# Altium project Volta_P0_Single_Port.PrjPcb (part 1 of 3)
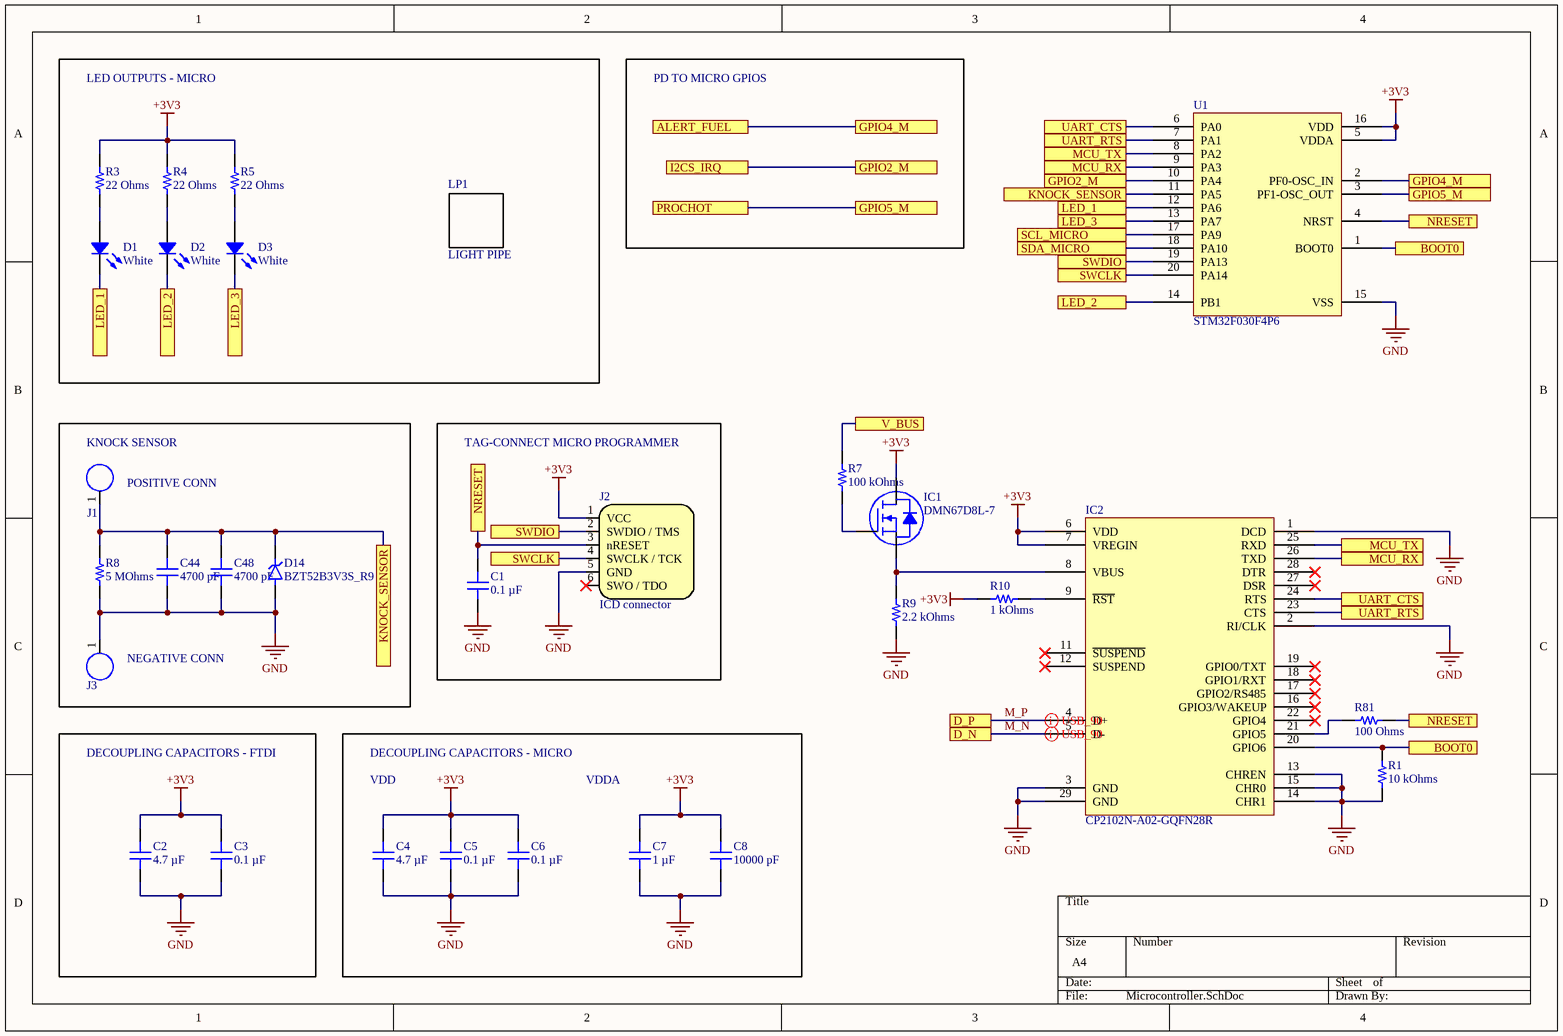
[diagram p0: Microcontroller.SchDoc]
7 sheets, 209 parts. Net scope: flat (ports and power ports of the same name join across sheets).
Board files: PCB.PcbDoc, Panel-Single.PcbDoc, Panel.PcbDoc
Sheets:
  Microcontroller.SchDoc
  PD_Controller_TI.SchDoc
  Charging_TI.SchDoc
  Charging_TI_2.SchDoc
  Fuel_Gauge.SchDoc
  Voltage_Regulation_TI.SchDoc
  I2C.SchDoc

## Sheet Microcontroller.SchDoc
size A4

### Parts
C1  0.1 µF  [CAP 0402_1005]
C2  4.7 µF  [CAP 0402_1005]
C3  0.1 µF  [CAP 0402_1005]
C4  4.7 µF  [CAP 0402_1005]
C5  0.1 µF  [CAP 0402_1005]
C6  0.1 µF  [CAP 0402_1005]
C7  1 µF  [CAP 0402_1005]
C8  10000 pF  [CAP 0402_1005]
C44  4700 pF  [CAP 0402_1005]
C48  4700 pF  [CAP 0402_1005]
D1  White  [LED 0805_2012]
D2  White  [LED 0805_2012]
D3  White  [LED 0805_2012]
D14  BZT52B3V3S_R9  [DIO_BZT52B3V3S_R9]
IC1  DMN67D8L-7  [DIODES SOT-23-3]
IC2  CP2102N-A02-GQFN28R  [SILICON LABS QFN-28 5x5MM]
J1  Large Board Solder Point  [Large Solder Point]  (value not drawn)  (no BOM)
J2  ICD connector  [TC2030-MCP]  (no BOM)
J3  Large Board Solder Point  [Large Solder Point]  (value not drawn)  (no BOM)
LP1  LIGHT PIPE  [Dialight 515-1069F]
R1  10 kOhms  [RES 0402_1005]
R3  22 Ohms  [RES 1206_3216]
R4  22 Ohms  [RES 1206_3216]
R5  22 Ohms  [RES 1206_3216]
R7  100 kOhms  [RES 0603_1608]
R8  5 MOhms  [RES 0603_1608]
R9  2.2 kOhms  [RES 0402_1005]
R10  1 kOhms  [RES 0402_1005]
R81  100 Ohms  [RES 0402_1005]
U1  STM32F030F4P6  [TSOP65P640X120-20N]

### Blocks framed on the sheet
LED OUTPUTS - MICRO: D1-D3 LP1 R3-R5
TAG-CONNECT MICRO PROGRAMMER: C1 J2
DECOUPLING CAPACITORS - FTDI: C2 C3

### Ports
ALERT_FUEL, BOOT0, D_N, D_P, GPIO2_M, GPIO4_M, GPIO5_M, I2CS_IRQ, KNOCK_SENSOR, LED_1, LED_2, LED_3, MCU_RX, MCU_TX, NRESET, PROCHOT, SCL_MICRO, SDA_MICRO, SWCLK, SWDIO, UART_CTS, UART_RTS, V_BUS

### Nets
+3V3: C2.2 C3.2 C4.2 C5.2 C6.2 C7.2 C8.2 IC1.3(D) IC2.6(VDD) IC2.7(VREGIN) J2.1(VCC) R3.2 R4.2 R5.2 R10.1 U1.5(VDDA) U1.16(VDD)
GND: C1.1 C2.1 C3.1 C4.1 C5.1 C6.1 C7.1 C8.1 C44.1 C48.1 D14.A IC2.1(DCD) IC2.2(RI/CLK) IC2.3(GND) IC2.13(CHREN) IC2.14(CHR1) IC2.15(CHR0) IC2.29(GND) J2.5(GND) J3.1 R1.2 R8.1 R9.1 U1.15(VSS)  [project net FUEL_BATT_SR_N]
ALERT_FUEL: U1.2(PF0-OSC_IN) ; port GPIO4_M, port ALERT_FUEL
BOOT0: IC2.20(GPIO6) R1.1 U1.1(BOOT0) ; port BOOT0
GPIO2_M: U1.10(PA4) ; port GPIO2_M, port I2CS_IRQ
GPIO5_M: U1.3(PF1-OSC_OUT) ; port GPIO5_M, port PROCHOT
I2CS_SCL: U1.17(PA9) ; port SCL_MICRO
I2CS_SDA: U1.18(PA10) ; port SDA_MICRO
KNOCK_SENSOR: C44.2 C48.2 D14.C(K) J1.1 R8.2 U1.11(PA5) ; port KNOCK_SENSOR
LED_1: D1.2 U1.12(PA6) ; port LED_1
LED_2: D2.2 U1.14(PB1) ; port LED_2
LED_3: D3.2 U1.13(PA7) ; port LED_3
M_N: IC2.5(D-) ; port D_N  [project net DCONN_N]
M_P: IC2.4(D+) ; port D_P  [project net DCONN_P]
MCU_RX: IC2.26(TXD) U1.9(PA3) ; port MCU_RX
MCU_TX: IC2.25(RXD) U1.8(PA2) ; port MCU_TX
NRESET: C1.2 J2.3(nRESET) R81.2 U1.4(NRST) ; port NRESET
SWCLK: J2.4(SWCLK_/_TCK) U1.20(PA14) ; port SWCLK
SWDIO: J2.2(SWDIO_/_TMS) U1.19(PA13) ; port SWDIO
UART_CTS: IC2.24(RTS) U1.6(PA0) ; port UART_CTS
UART_RTS: IC2.23(CTS) U1.7(PA1) ; port UART_RTS
V_BUS: R7.2 ; port V_BUS
NetD1_1: D1.1 R3.1
NetD2_1: D2.1 R4.1
NetD3_1: D3.1 R5.1
NetIC1_1: IC1.1(G) R7.1
NetIC1_2: IC1.2(S) IC2.8(VBUS) R9.2
NetIC2_9: IC2.9(~{RST}) R10.2
NetIC2_21: IC2.21(GPIO5) R81.1

Not connected (* = marked no-connect by the designer): IC2 11(~{SUSPEND})* 12(SUSPEND)* 16(GPIO3/WAKEUP)* 17(GPIO2/RS485)* 18(GPIO1/RXT)* 19(GPIO0/TXT)* 22(GPIO4)* 27(DSR)* 28(DTR)*; J2 6(SWO_/_TDO)*

### Layout directives
differential pair; differential pair class USB_90: DCONN_N, DCONN_P

### Notes on the sheet
- PD TO MICRO GPIOS
- (near J1) KNOCK SENSOR
- (near J1) POSITIVE CONN
- (near J3) NEGATIVE CONN
- DECOUPLING CAPACITORS - MICRO
- VDD
- VDDA

### Library data of the parts
C1 C3 C5 C6 = LMK105BJ104MC-F: CAP CER 0.1UF 10V X5R 0402; manufacturer: Taiyo Yuden; Tolerance: ±20%; Part Number: LMK105BJ104MC-F; Value: 0.1 µF; Applications: SMPS Filtering; Capacitance: 0.1 µF; componentlink1description: Datasheet; componentlink1url: https://www.yuden.co.jp/productdata/catalog/mlcc01_e.pdf; componentlink2description: DigiKey Link; componentlink2url: https://www.digikey.com/en/products/detail/taiyo-yuden/LMK105BJ104MC-F/6035743; Device Package: 0402 (1005 Metric); lastupdated: 9/08/2022 12:01:16 PM; Lifecycle Status: Active; Minimum Order: 1; Mounting Type: Surface Mount, MLCC; Operating Temperature: -55°C ~ 85°C; Package / Case: 0402 (1005 Metric); packaging: TapeAndReel; partid: 2414; Part Status: Active; price: 0.03; series: M; Size / Dimension: 0.039" L x 0.020" W (1.00mm x 0.50mm); Supplier 1: DigiKey; Supplier Part Number 1: 587-4572-1-ND; Temperature Coefficient: X5R; Thickness (Max): 0.009" (0.22mm); Voltage - Rated: 10V
C2 C4 = CL05A475KP5NRNC: CAP CER 4.7UF 10V X5R 0402; manufacturer: Samsung Electro-Mechanics; Tolerance: ±10%; Part Number: CL05A475KP5NRNC; Value: 4.7 µF; Applications: General Purpose; Capacitance: 4.7 µF; componentlink1description: Datasheet; componentlink1url: http://www.samsungsem.com/kr/support/product-search/mlcc/CL05A475KP5NRNC.jsp; componentlink2description: DigiKey Link; componentlink2url: https://www.digikey.com/en/products/detail/samsung-electro-mechanics/CL05A475KP5NRNC/3887138; Device Package: 0402 (1005 Metric); lastupdated: 9/08/2022 12:01:16 PM; Lifecycle Status: Active; Minimum Order: 1; Mounting Type: Surface Mount, MLCC; Operating Temperature: -55°C ~ 85°C; Package / Case: 0402 (1005 Metric); packaging: TapeAndReel; partid: 2191; Part Status: Active; price: 0.04; series: CL; Size / Dimension: 0.039" L x 0.020" W (1.00mm x 0.50mm); Supplier 1: DigiKey; Supplier Part Number 1: 1276-1480-1-ND; Temperature Coefficient: X5R; Thickness (Max): 0.022" (0.55mm); Voltage - Rated: 10V
C7 = LMK105BJ105KPLF: CAP CER 1UF 10V X5R 0402; manufacturer: Taiyo Yuden; Tolerance: ±10%; Part Number: LMK105BJ105KPLF; Value: 1 µF; Applications: SMPS Filtering; Capacitance: 1 µF; componentlink1description: Datasheet; componentlink1url: https://ds.yuden.co.jp/TYCOMPAS/ut/detail?pn=LMK105BJ105KPLF &u=M; componentlink2description: DigiKey Link; componentlink2url: https://www.digikey.com/en/products/detail/taiyo-yuden/LMK105BJ105KPLF/7403744; Device Package: 0402 (1005 Metric); lastupdated: 9/08/2022 12:01:16 PM; Lifecycle Status: Active; Minimum Order: 1; Mounting Type: Surface Mount, MLCC; Operating Temperature: -55°C ~ 85°C; Package / Case: 0402 (1005 Metric); packaging: TapeAndReel; partid: 2328; Part Status: Active; price: 0.02; series: M; Size / Dimension: 0.039" L x 0.020" W (1.00mm x 0.50mm); Supplier 1: DigiKey; Supplier Part Number 1: 587-6274-1-ND; Temperature Coefficient: X5R; Thickness (Max): 0.026" (0.65mm); Voltage - Rated: 10V
C8 = LMF105B7103KVHF: CAP, MLCC, 0402/1005, 10V, X7R,; manufacturer: Taiyo Yuden; Tolerance: ±10%; Part Number: LMF105B7103KVHF; Value: 10000 pF; Applications: Automotive, SMPS Filtering; Capacitance: 10000 pF; componentlink1description: Datasheet; componentlink1url: https://ds.yuden.co.jp/TYCOMPAS/ut/detail?pn=LMF105B7103KVHF&u=M; componentlink2description: DigiKey Link; componentlink2url: https://www.digikey.com/en/products/detail/taiyo-yuden/LMF105B7103KVHF/10379145; Device Package: 0402 (1005 Metric); lastupdated: 9/08/2022 12:01:17 PM; Lifecycle Status: Active; Minimum Order: 1; Mounting Type: Surface Mount, MLCC; Operating Temperature: -55°C ~ 125°C; Package / Case: 0402 (1005 Metric); packaging: TapeAndReel; partid: 1869; Part Status: Active; price: 0.01; Ratings: AEC-Q200; series: M; Size / Dimension: 0.039" L x 0.020" W (1.00mm x 0.50mm); Supplier 1: DigiKey; Supplier Part Number 1: 587-6579-1-ND; Temperature Coefficient: X7R; Thickness (Max): 0.022" (0.55mm); Voltage - Rated: 10V
C44 C48 = 0402B472J500CT: CAP CER 4700PF 50V X7R 0402; manufacturer: Walsin Technology Corporation; Tolerance: ±5%; Part Number: 0402B472J500CT; Value: 4700 pF; Applications: General Purpose; Capacitance: 4700 pF; componentlink1description: Datasheet; componentlink1url: http://www.passivecomponent.com/wp-content/uploads/2018/10/MLCC.pdf; componentlink2description: DigiKey Link; componentlink2url: https://www.digikey.com/en/products/detail/walsin-technology-corporation/0402B472J500CT/9354708; Device Package: 0402 (1005 Metric); lastupdated: 11/05/2023 7:06:21 PM; Lifecycle Status: Active; Minimum Order: 1; Mounting Type: Surface Mount, MLCC; Operating Temperature: -55°C ~ 125°C; Package / Case: 0402 (1005 Metric); packaging: TapeAndReel; partid: 1879; Part Status: Active; price: 0.01; series: -; Size / Dimension: 0.039" L x 0.020" W (1.00mm x 0.50mm); Supplier 1: DigiKey; Supplier Part Number 1: 1292-1210-1-ND; Temperature Coefficient: X7R; Thickness (Max): 0.022" (0.55mm); Voltage - Rated: 50V
D1-D3 = QBLP631-IW5: 0805 LED WHITE, YELLOW DIFFUSED; Manufacturer: QT Brightek (QTB); Configuration: Standard; Current - Test: 5mA; Lens Size: 1.30mm x 1.25mm; Lens Style: Rectangle with Flat Top; Millicandela Rating: 85mcd; Viewing Angle: 140°; Voltage - Forward (Vf) (Typ): 2.9V; Part Number: QBLP631-IW5; Color: White; ComponentLink1Description: Datasheet; ComponentLink1URL: https://www.qt-brightek.com/datasheet/QBLP631-IW5.pdf; ComponentLink2Description: DigiKey Link; ComponentLink2URL: https://www.digikey.com/en/products/detail/qt-brightek-qtb/QBLP631-IW5/16499651; Device Package: 0805 (2012 Metric); Height (Max): 0.90mm; LastUpdated: 9/08/2022 12:43:05 PM; Lens Color: Yellow; Lens Transparency: Diffused; Lifecycle Status: Active; Minimum Order: 1; Mounting Type: Surface Mount; Package / Case: 0805 (2012 Metric); Packaging: TapeAndReel; PartId: 1097; Part Status: Active; Price: 0.08; Series: QBLP631; Size / Dimension: 2.00mm L x 1.25mm W; Supplier 1: DigiKey; Supplier Part Number 1: 1516-QBLP631-IW5CT-ND; Supplier Device Package: 0805; Value: White
D14 = BZT52B3V3S_R9: MF: {'manufacturer': u'Taiwan Semiconductor'}; Package: None; Price: None; Value: *; MP: BZT52B3V3S_R9; Availability: Unavailable
IC1 = DMN67D8L-7: MOSFET N-CH 60V 210MA SOT23; Manufacturer: Diodes Incorporated; Current - Continuous Drain (Id) @ 25°C: 210mA (Ta); Drive Voltage (Max Rds On,  Min Rds On): 5V, 10V; FET Type: N-Channel; Gate Charge (Qg) (Max) @ Vgs: 0.82 nC @ 10 V; Input Capacitance (Ciss) (Max) @ Vds: 22 pF @ 25 V; Power Dissipation (Max): 340mW (Ta); Rds On (Max) @ Id, Vgs: 5Ohm @ 500mA, 10V; Vgs (Max): ±30V; Vgs(th) (Max) @ Id: 2.5V @ 250µA; Part Number: DMN67D8L-7; ComponentLink1Description: Datasheet; ComponentLink1URL: https://www.diodes.com/assets/Datasheets/DMN67D8L.pdf; ComponentLink2Description: DigiKey Link; ComponentLink2URL: https://www.digikey.com/en/products/detail/diodes-incorporated/DMN67D8L-7/5768832; Drain to Source Voltage (Vdss): 60 V; LastUpdated: 9/08/2022 12:48:06 PM; Lifecycle Status: Active; Minimum Order: 1; Mounting Type: Surface Mount; Operating Temperature: -55°C ~ 150°C (TJ); Package / Case: TO-236-3, SC-59, SOT-23-3; Packaging: TapeAndReel; Part Status: Active; Price: 0.03; Series: -; Supplier 1: DigiKey; Supplier Part Number 1: DMN67D8L-7DICT-ND; Supplier Device Package: SOT-23-3; Technology: MOSFET (Metal Oxide)
IC2 = CP2102N-A02-GQFN28R: IC USB TO UART BRIDGE QFN28; Manufacturer: Silicon Labs; Current - Supply: 9.5mA; Function: Bridge, USB to UART; Standards: USB 2.0; Voltage - Supply: 3V ~ 3.6V; Part Number: CP2102N-A02-GQFN28R; ComponentLink1Description: Datasheet; ComponentLink1URL: https://www.silabs.com/documents/public/data-sheets/cp2102n-datasheet.pdf; ComponentLink2Description: DigiKey Link; ComponentLink2URL: http://digikey.com/product-detail/en/silicon-labs/CP2102N-A02-GQFN28R/336-5890-1-ND/9863483; Interface: UART; LastUpdated: 31/07/2020 4:26:30 PM; Lifecycle Status: Active; Minimum Order: 1; Operating Temperature: -40°C ~ 85°C (TA); Package / Case: 28-WFQFN Exposed Pad; Packaging: TapeAndReel; Part Status: Active; Price: 1.23; Protocol: USB; Series: USBXpress™; Supplier 1: DigiKey; Supplier Part Number 1: 336-5890-1-ND; Supplier Device Package: 28-QFN (5x5)
J2 = TC2030-MCP-NL: Conector par ICD
LP1 = Dialight 515-1069F: Light Pipe Dialight 515-1069F
R1 = RC0402JR-1310KL: RES 10K OHM 5% 1/16W 0402; Manufacturer: Yageo; Power (Watts): 0.063W, 1/16W; Temperature Coefficient: ±100ppm/°C; Part Number: RC0402JR-1310KL; Value: 10 kOhms; ComponentLink1Description: Datasheet; ComponentLink1URL: https://www.yageo.com/upload/media/product/productsearch/datasheet/rchip/PYu-RC_Group_51_RoHS_L_11.pdf; ComponentLink2Description: DigiKey Link; ComponentLink2URL: https://www.digikey.com/en/products/detail/yageo/RC0402JR-1310KL/13694115; Composition: Thick Film; Device Package: 0402 (1005 Metric); Features: Moisture Resistant; Height - Seated (Max): 0.016" (0.40mm); LastUpdated: 4/04/2023 7:21:31 PM; Lifecycle Status: Active; Minimum Order: 50000; Number of Terminations: 2; Operating Temperature: -55°C ~ 155°C; Package / Case: 0402 (1005 Metric); PartId: 69237; Part Status: Active; Price: 0; Resistance: 10 kOhms; Series: RC_L; Size / Dimension: 0.039" L x 0.020" W (1.00mm x 0.50mm); Supplier 1: DigiKey; Supplier Part Number 1: 13-RC0402JR-1310KLTR-ND; Supplier Device Package: 0402; Tolerance: ±5%
R3-R5 = HRG3216Q-22R0-D-T1: RES SMD 22 OHM 0.5% 1W 1206; Manufacturer: Susumu; Temperature Coefficient: ±50ppm/°C; Part Number: HRG3216Q-22R0-D-T1; ComponentLink1Description: Datasheet; ComponentLink1URL: http://www.susumu.co.jp/common/pdf/n_catalog_partition24_en.pdf; ComponentLink2Description: DigiKey Link; ComponentLink2URL: https://www.digikey.com/en/products/detail/susumu/HRG3216Q-22R0-D-T1/5762558; Composition: Thin Film; Device Package: 1206 (3216 Metric); Features: Anti-Sulfur, Automotive AEC-Q200, Moisture Resistant; Height - Seated (Max): 0.022" (0.55mm); LastUpdated: 19/09/2022 1:29:16 PM; Lifecycle Status: Active; Minimum Order: 1; Number of Terminations: 2; Operating Temperature: -55°C ~ 155°C; Package / Case: 1206 (3216 Metric); Packaging: TapeAndReel; PartId: 35615; Part Status: Active; Power (Watts): 1W; Price: 0.30; Ratings: AEC-Q200; Resistance: 22 Ohms; Series: HRG; Size / Dimension: 0.126" L x 0.065" W (3.20mm x 1.65mm); Supplier 1: DigiKey; Supplier Part Number 1: 408-1897-1-ND; Supplier Device Package: 1206; Tolerance: ±0.5%; Value: 22 Ohms
R7 = RNCS0603BKE100K: RES 100K OHM 0.1% 1/16W 0603; Manufacturer: Stackpole Electronics Inc; Power (Watts): 0.063W, 1/16W; Temperature Coefficient: ±25ppm/°C; Part Number: RNCS0603BKE100K; Value: 100 kOhms; ComponentLink1Description: Datasheet; ComponentLink1URL: https://www.seielect.com/catalog/sei-rncs_rnch.pdf; ComponentLink2Description: DigiKey Link; ComponentLink2URL: https://www.digikey.com/en/products/detail/stackpole-electronics-inc/RNCS0603BKE100K/1708835; Composition: Thin Film; Device Package: 0603 (1608 Metric); Features: Anti-Corrosive, Automotive AEC-Q200, Moisture Resistant; Height - Seated (Max): 0.022" (0.55mm); LastUpdated: 19/09/2022 1:22:34 PM; Lifecycle Status: Active; Minimum Order: 1; Number of Terminations: 2; Operating Temperature: -55°C ~ 155°C; Package / Case: 0603 (1608 Metric); Packaging: TapeAndReel; PartId: 4849; Part Status: Active; Price: 0.08; Ratings: AEC-Q200; Resistance: 100 kOhms; Series: RNCS; Size / Dimension: 0.061" L x 0.031" W (1.55mm x 0.80mm); Supplier 1: DigiKey; Supplier Part Number 1: RNCS0603BKE100KCT-ND; Supplier Device Package: 0603; Tolerance: ±0.1%
R8 = HVC0603T5004FET: RES SMD 5M OHM 1% 1/10W 0603; Manufacturer: Ohmite; Power (Watts): 0.1W, 1/10W; Temperature Coefficient: ±100ppm/°C; Part Number: HVC0603T5004FET; Value: 5 MOhms; ComponentLink1Description: Datasheet; ComponentLink1URL: http://www.ohmite.com/assets/docs/res_hvc.pdf?r=false; ComponentLink2Description: DigiKey Link; ComponentLink2URL: https://www.digikey.com/en/products/detail/ohmite/HVC0603T5004FET/4759723; Composition: Thick Film; Device Package: 0603 (1608 Metric); Features: High Voltage; Height - Seated (Max): 0.022" (0.55mm); LastUpdated: 11/07/2023 7:33:32 PM; Lifecycle Status: Active; Minimum Order: 1; Number of Terminations: 2; Operating Temperature: -55°C ~ 155°C; Package / Case: 0603 (1608 Metric); Packaging: TapeAndReel; PartId: 18926; Part Status: Active; Price: 0.68; Resistance: 5 MOhms; Series: HVC; Size / Dimension: 0.059" L x 0.031" W (1.50mm x 0.80mm); Supplier 1: DigiKey; Supplier Part Number 1: HVC0603T5004FETCT-ND; Supplier Device Package: 0603; Tolerance: ±1%
R9 = TNPW04022K20BYEP: RES 2.2K OHM 0.1% 1/10W 0402; Manufacturer: Vishay Dale; Power (Watts): 0.1W, 1/10W; Temperature Coefficient: ±10ppm/°C; Part Number: TNPW04022K20BYEP; Value: 2.2 kOhms; ComponentLink1Description: Datasheet; ComponentLink1URL: http://www.vishay.com/docs/28758/tnpw_e3.pdf; ComponentLink2Description: DigiKey Link; ComponentLink2URL: https://www.digikey.com/en/products/detail/vishay-dale/TNPW04022K20BYEP/8636618; Composition: Thin Film; Device Package: 0402 (1005 Metric); Features: Anti-Sulfur, Automotive AEC-Q200, Moisture Resistant; Height - Seated (Max): 0.016" (0.40mm); LastUpdated: 9/08/2022 12:11:02 PM; Lifecycle Status: Active; Minimum Order: 1; Number of Terminations: 2; Operating Temperature: -55°C ~ 155°C; Package / Case: 0402 (1005 Metric); Packaging: TapeAndReel; PartId: 3077; Part Status: Active; Price: 0.28; Ratings: AEC-Q200; Resistance: 2.2 kOhms; Series: TNPW e3; Size / Dimension: 0.039" L x 0.020" W (1.00mm x 0.50mm); Supplier 1: DigiKey; Supplier Part Number 1: 541-9805-1-ND; Supplier Device Package: 0402; Tolerance: ±0.1%
R10 = AF0402JR-071KL: RES SMD 1K OHM 5% 1/16W 0402; Manufacturer: Yageo; Power (Watts): 0.063W, 1/16W; Temperature Coefficient: ±100ppm/°C; Part Number: AF0402JR-071KL; Value: 1 kOhms; ComponentLink1Description: Datasheet; ComponentLink1URL: https://www.yageo.com/upload/media/product/productsearch/datasheet/rchip/PYu-AF_51_RoHS_L_6.pdf; ComponentLink2Description: DigiKey Link; ComponentLink2URL: https://www.digikey.com/en/products/detail/yageo/AF0402JR-071KL/5900732; Composition: Thick Film; Device Package: 0402 (1005 Metric); Features: Anti-Sulfur, Automotive AEC-Q200; Height - Seated (Max): 0.015" (0.37mm); LastUpdated: 9/08/2022 12:09:39 PM; Lifecycle Status: Active; Minimum Order: 1; Number of Terminations: 2; Operating Temperature: -55°C ~ 155°C; Package / Case: 0402 (1005 Metric); Packaging: CutTape; PartId: 68908; Part Status: Active; Price: 0.01; Ratings: AEC-Q200; Resistance: 1 kOhms; Series: AF; Size / Dimension: 0.039" L x 0.020" W (1.00mm x 0.50mm); Supplier 1: DigiKey; Supplier Part Number 1: 13-AF0402JR-071KLCT-ND; Supplier Device Package: 0402; Tolerance: ±5%
R81 = MCS0402PD1000DE500: RES 100 OHM 0.5% 1/5W 0402; Manufacturer: Vishay Beyschlag; Power (Watts): 0.2W, 1/5W; Temperature Coefficient: ±25ppm/°C; Part Number: MCS0402PD1000DE500; Value: 100 Ohms; ComponentLink1Description: Datasheet; ComponentLink1URL: http://www.vishay.com/docs/28916/mcxhp.pdf; ComponentLink2Description: DigiKey Link; ComponentLink2URL: http://digikey.com/product-detail/en/vishay-beyschlag/MCS0402PD1000DE500/749-1509-1-ND/7245027; Composition: Thin Film; Device Package: 0402 (1005 Metric); Features: Anti-Sulfur, Automotive AEC-Q200; Height - Seated (Max): 0.015" (0.37mm); LastUpdated: 17/07/2023 7:08:51 PM; Lifecycle Status: Active; Minimum Order: 1; Number of Terminations: 2; Operating Temperature: -55°C ~ 175°C; Package / Case: 0402 (1005 Metric); Packaging: TapeAndReel; PartId: 2456; Part Status: Active; Price: 0.08; Ratings: AEC-Q200; Resistance: 100 Ohms; Series: MCS HP; Size / Dimension: 0.039" L x 0.020" W (1.00mm x 0.50mm); Supplier 1: DigiKey; Supplier Part Number 1: 749-1509-1-ND; Supplier Device Package: 0402; Tolerance: ±0.5%
U1 = STM32F030F4P6: Value-line Arm-based 32-bit MCU with up to 256 KB Flash, timers, ADC, communication interfaces, 2.4-3.6 V operation - TSSOP20 20-pin

## Sheet PD_Controller_TI.SchDoc
size A4
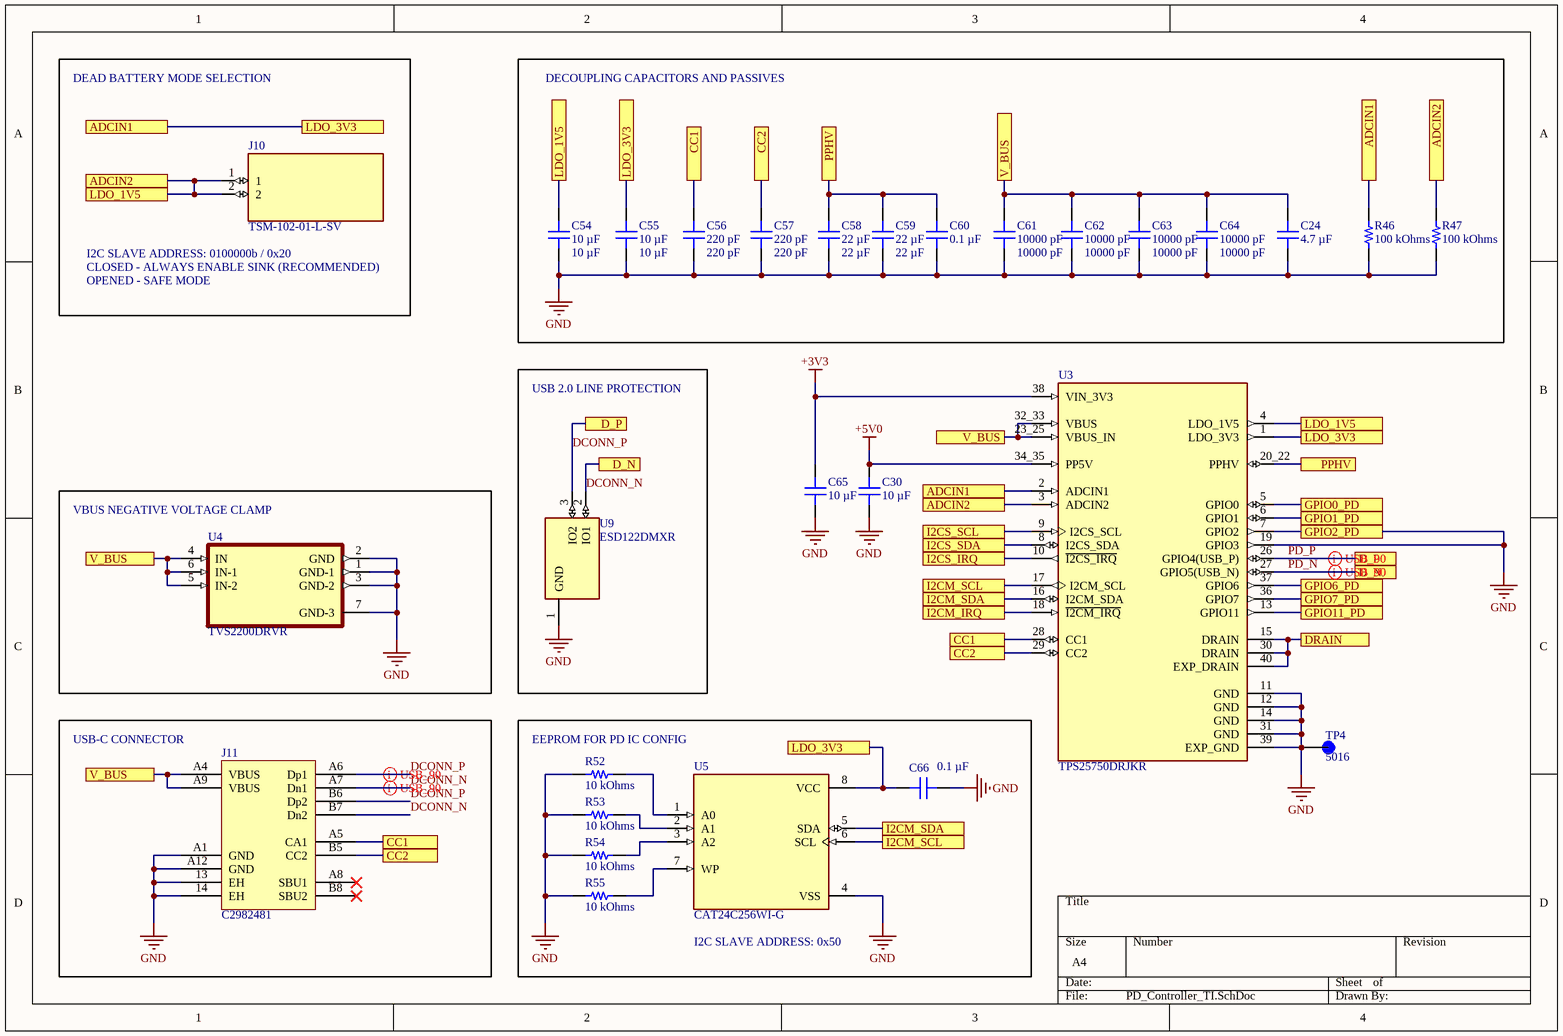
[diagram p1: PD_Controller_TI.SchDoc]

### Parts
C24  4.7 µF  [CAP 0603_1608]
C30  10 µF  [CAP 0402_1005]
C54  10 µF  [CAP 0402_1005]
C55  10 µF  [CAP 0402_1005]
C56  220 pF  [CAP 0402_1005]
C57  220 pF  [CAP 0402_1005]
C58  22 µF  [CAP 0805_2012]
C59  22 µF  [CAP 0805_2012]
C60  0.1 µF  [CAP 0402_1005]
C61  10000 pF  [CAP 0402_1005]
C62  10000 pF  [CAP 0402_1005]
C63  10000 pF  [CAP 0402_1005]
C64  10000 pF  [CAP 0402_1005]
C65  10 µF  [CAP 0402_1005]
C66  0.1 µF  [CAP 0402_1005]
J10  TSM-102-01-L-SV  [TSM-102-01-L-SV]  (no BOM)
J11  C2982481  [GT-USB-7079A]
R46  100 kOhms  [RES 0402_1005]
R47  100 kOhms  [RES 0402_1005]
R52  10 kOhms  [RES 0402_1005]
R53  10 kOhms  [RES 0402_1005]
R54  10 kOhms  [RES 0402_1005]
R55  10 kOhms  [RES 0402_1005]
TP4  5016  [KEYSTONE_5016]  (no BOM)
U3  TPS25750DRJKR  [IC_TPS25750DRJKR]
U4  TVS2200DRVR  [SON65P200X200X80-7N]
U5  CAT24C256WI-G  [SOIC127P600X175-8N]
U9  ESD122DMXR  [IC_ESD122DMXR]

### Blocks framed on the sheet
DECOUPLING CAPACITORS AND PASSIVES: C24 C54-C64 R46 R47
USB 2.0 LINE PROTECTION: U9
VBUS NEGATIVE VOLTAGE CLAMP: U4
USB-C CONNECTOR: J11

### Ports
ADCIN1, ADCIN2, CC1, CC2, D_N, D_P, DRAIN, GPIO0_PD, GPIO1_PD, GPIO2_PD, GPIO6_PD, GPIO7_PD, GPIO11_PD, I2CM_IRQ, I2CM_SCL, I2CM_SDA, I2CS_IRQ, I2CS_SCL, I2CS_SDA, LDO_1V5, LDO_3V3, PPHV, V_BUS

### Nets
+3V3: C65.1 U3.38(VIN_3V3)
+5V0: C30.1 U3.34_35(PP5V)
GND: C24.1 C30.2 C54.1 C55.1 C56.2 C57.2 C58.1 C59.1 C60.2 C61.1 C62.1 C63.1 C64.1 C65.2 C66.1 J11.13(EH) J11.14(EH) J11.A1(GND) J11.A12(GND) R46.1 R47.1 R52.2 R53.2 R54.2 R55.2 TP4.TP U3.7(GPIO2) U3.11(GND) U3.12(GND) U3.14(GND) U3.19(GPIO3) U3.31(GND) U3.39(EXP_GND) U4.1(GND-1) U4.2(GND) U4.3(GND-2) U4.7(GND-3) U5.4(VSS) U9.1(GND) ; port GPIO2_PD  [project net FUEL_BATT_SR_N]
ADCIN1: C55.2 C66.2 R46.2 U3.1(LDO_3V3) U3.2(ADCIN1) U5.8(VCC) ; port LDO_3V3, port ADCIN1
ADCIN2: C54.2 J10.1 J10.2 R47.2 U3.3(ADCIN2) U3.4(LDO_1V5) ; port LDO_1V5, port ADCIN2
CC1: C56.1 J11.A5(CA1) U3.28(CC1) ; port CC1
CC2: C57.1 J11.B5(CC2) U3.29(CC2) ; port CC2
DCONN_N: J11.A7(Dn1) J11.B7(Dn2) U3.27(GPIO5(USB_N)) U9.2(IO1) ; port D_N  [also labelled PD_N]
DCONN_P: J11.A6(Dp1) J11.B6(Dp2) U3.26(GPIO4(USB_P)) U9.3(IO2) ; port D_P  [also labelled PD_P]
DRAIN: U3.15(DRAIN) U3.30(DRAIN) U3.40(EXP_DRAIN) ; port DRAIN
GPIO0_PD: U3.5(GPIO0) ; port GPIO0_PD
GPIO1_PD: U3.6(GPIO1) ; port GPIO1_PD
GPIO2_M: U3.10(~{I2CS_IRQ}) ; port I2CS_IRQ
GPIO6_PD: U3.37(GPIO6) ; port GPIO6_PD
GPIO7_PD: U3.36(GPIO7) ; port GPIO7_PD
GPIO11_PD: U3.13(GPIO11) ; port GPIO11_PD
I2CM_IRQ: U3.18(~{I2CM_IRQ}) ; port I2CM_IRQ
I2CM_SCL: U3.17(I2CM_SCL) U5.6(SCL) ; port I2CM_SCL
I2CM_SDA: U3.16(I2CM_SDA) U5.5(SDA) ; port I2CM_SDA
I2CS_SCL: U3.9(I2CS_SCL) ; port I2CS_SCL
I2CS_SDA: U3.8(I2CS_SDA) ; port I2CS_SDA
PPHV: C58.2 C59.2 C60.1 U3.20_22(PPHV) ; port PPHV
V_BUS: C24.2 C61.2 C62.2 C63.2 C64.2 J11.A4(VBUS) J11.A9(VBUS) U3.23_25(VBUS_IN) U3.32_33(VBUS) U4.4(IN) U4.5(IN-2) U4.6(IN-1) ; port V_BUS
NetR52_1: R52.1 U5.1(A0)
NetR53_1: R53.1 U5.2(A1)
NetR54_1: R54.1 U5.3(A2)
NetR55_1: R55.1 U5.7(WP)

Not connected (* = marked no-connect by the designer): J11 A8(SBU1)* B8(SBU2)*

### Layout directives
differential pair; differential pair class USB_90: DCONN_N, DCONN_P

### Notes on the sheet
- DEAD BATTERY MODE SELECTION
- CLOSED - ALWAYS ENABLE SINK (RECOMMENDED)
- OPENED - SAFE MODE
- I2C SLAVE ADDRESS: 0100000b / 0x20
- (near R52) EEPROM FOR PD IC CONFIG
- (near U5) I2C SLAVE ADDRESS: 0x50

### Library data of the parts
C24 = C1608X5R1V475K080AC: CAP CER 4.7UF 35V X5R 0603; manufacturer: TDK Corporation; Tolerance: ±10%; Part Number: C1608X5R1V475K080AC; Value: 4.7 µF; Applications: General Purpose; Capacitance: 4.7 µF; componentlink1description: Datasheet; componentlink1url: https://product.tdk.com/info/en/catalog/datasheets/mlcc_commercial_general_en.pdf?ref_disty=digikey; componentlink2description: DigiKey Link; componentlink2url: https://www.digikey.com/en/products/detail/tdk-corporation/C1608X5R1V475K080AC/3648577; Device Package: 0603 (1608 Metric); Features: Low ESL; lastupdated: 9/05/2023 7:14:01 PM; Lifecycle Status: Active; Minimum Order: 1; Mounting Type: Surface Mount, MLCC; Operating Temperature: -55°C ~ 85°C; Package / Case: 0603 (1608 Metric); packaging: TapeAndReel; partid: 2627; Part Status: Active; price: 0.08; series: C; Size / Dimension: 0.063" L x 0.031" W (1.60mm x 0.80mm); Supplier 1: DigiKey; Supplier Part Number 1: 445-9064-1-ND; Temperature Coefficient: X5R; Thickness (Max): 0.039" (1.00mm); Voltage - Rated: 35V
C30 C54 C55 C65 = CL05A106MP8NUB8: CAP CER 10UF 10V X5R 0402; manufacturer: Samsung Electro-Mechanics; Tolerance: ±20%; Part Number: CL05A106MP8NUB8; Value: 10 µF; Applications: Acoustic Noise Reduction; Capacitance: 10 µF; componentlink1description: Datasheet; componentlink1url: http://www.samsungsem.com/kr/support/product-search/mlcc/CL05A106MP8NUB8.jsp; componentlink2description: DigiKey Link; componentlink2url: https://www.digikey.com/en/products/detail/samsung-electro-mechanics/CL05A106MP8NUB8/5961314; Device Package: 0402 (1005 Metric); lastupdated: 26/04/2023 7:02:37 PM; Lifecycle Status: Active; Minimum Order: 1; Mounting Type: Surface Mount, MLCC; Operating Temperature: -55°C ~ 85°C; Package / Case: 0402 (1005 Metric); packaging: TapeAndReel; partid: 1758; Part Status: Active; price: 0.06; series: CL; Size / Dimension: 0.039" L x 0.020" W (1.00mm x 0.50mm); Supplier 1: DigiKey; Supplier Part Number 1: 1276-6830-1-ND; Temperature Coefficient: X5R; Thickness (Max): 0.035" (0.90mm); Voltage - Rated: 10V
C56 C57 = 885012205021: CAP CER 220PF 16V X7R 0402; manufacturer: Würth Elektronik; Tolerance: ±10%; Part Number: 885012205021; Value: 220 pF; Applications: General Purpose; Capacitance: 220 pF; componentlink1description: Datasheet; componentlink1url: https://katalog.we-online.de/pbs/datasheet/885012205021.pdf; componentlink2description: DigiKey Link; componentlink2url: https://www.digikey.com/en/products/detail/würth-elektronik/885012205021/5453371; Device Package: 0402 (1005 Metric); lastupdated: 26/04/2023 7:02:36 PM; Lifecycle Status: Active; Minimum Order: 1; Mounting Type: Surface Mount, MLCC; Operating Temperature: -55°C ~ 125°C; Package / Case: 0402 (1005 Metric); packaging: TapeAndReel; partid: 2015; Part Status: Active; price: 0.01; series: WCAP-CSGP; Size / Dimension: 0.039" L x 0.020" W (1.00mm x 0.50mm); Supplier 1: DigiKey; Supplier Part Number 1: 732-7516-1-ND; Temperature Coefficient: X7R; Thickness (Max): 0.022" (0.55mm); Voltage - Rated: 16V
C58 C59 = C2012X5R1V226M125AC: CAP CER 22UF 35V X5R 0805; manufacturer: TDK Corporation; Tolerance: ±20%; Part Number: C2012X5R1V226M125AC; Value: 22 µF; Applications: General Purpose; Capacitance: 22 µF; componentlink1description: Datasheet; componentlink1url: https://product.tdk.com/info/en/catalog/datasheets/mlcc_commercial_general_en.pdf?ref_disty=digikey; componentlink2description: DigiKey Link; componentlink2url: https://www.digikey.com/en/products/detail/tdk-corporation/C2012X5R1V226M125AC/3951664; Device Package: 0805 (2012 Metric); Features: Low ESL; lastupdated: 26/04/2023 7:09:36 PM; Lifecycle Status: Active; Minimum Order: 1; Mounting Type: Surface Mount, MLCC; Operating Temperature: -55°C ~ 85°C; Package / Case: 0805 (2012 Metric); packaging: TapeAndReel; partid: 45365; Part Status: Active; price: 0.28; series: C; Size / Dimension: 0.079" L x 0.049" W (2.00mm x 1.25mm); Supplier 1: DigiKey; Supplier Part Number 1: 445-14428-1-ND; Temperature Coefficient: X5R; Thickness (Max): 0.057" (1.45mm); Voltage - Rated: 35V
C60 C66 = 885012105001: CAP CER 0.1UF 6.3V X5R 0402; manufacturer: Würth Elektronik; Tolerance: ±20%; Part Number: 885012105001; Value: 0.1 µF; Applications: General Purpose; Capacitance: 0.1 µF; componentlink1description: Datasheet; componentlink1url: https://katalog.we-online.de/pbs/datasheet/885012105001.pdf; componentlink2description: DigiKey Link; componentlink2url: https://www.digikey.com/en/products/detail/würth-elektronik/885012105001/5453333; Device Package: 0402 (1005 Metric); lastupdated: 26/04/2023 7:02:37 PM; Lifecycle Status: Active; Minimum Order: 1; Mounting Type: Surface Mount, MLCC; Operating Temperature: -55°C ~ 85°C; Package / Case: 0402 (1005 Metric); packaging: TapeAndReel; partid: 1931; Part Status: Active; price: 0.01; series: WCAP-CSGP; Size / Dimension: 0.039" L x 0.020" W (1.00mm x 0.50mm); Supplier 1: DigiKey; Supplier Part Number 1: 732-7478-1-ND; Temperature Coefficient: X5R; Thickness (Max): 0.022" (0.55mm); Voltage - Rated: 6.3V
C61-C64 = CGA2B3X7R1V103M050BB: CAP CER 10000PF 35V X7R 0402; manufacturer: TDK Corporation; Tolerance: ±20%; Part Number: CGA2B3X7R1V103M050BB; Value: 10000 pF; Applications: Automotive; Capacitance: 10000 pF; componentlink1description: Datasheet; componentlink1url: https://product.tdk.com/info/en/catalog/datasheets/mlcc_automotive_general_en.pdf?ref_disty=digikey; componentlink2description: DigiKey Link; componentlink2url: https://www.digikey.com/en/products/detail/tdk-corporation/CGA2B3X7R1V103M050BB/3949489; Device Package: 0402 (1005 Metric); lastupdated: 26/04/2023 7:02:37 PM; Lifecycle Status: Active; Minimum Order: 1; Mounting Type: Surface Mount, MLCC; Operating Temperature: -55°C ~ 125°C; Package / Case: 0402 (1005 Metric); packaging: TapeAndReel; partid: 1926; Part Status: Active; price: 0.01; Ratings: AEC-Q200; series: CGA; Size / Dimension: 0.039" L x 0.020" W (1.00mm x 0.50mm); Supplier 1: DigiKey; Supplier Part Number 1: 445-12253-1-ND; Temperature Coefficient: X7R; Thickness (Max): 0.022" (0.55mm); Voltage - Rated: 35V
J10 = TSM-102-01-L-SV: MF: {'manufacturer': u'Samtec Inc.'}; Value: *; Package: None; Price: None; MP: TSM-102-01-L-SV; Availability: Unavailable
J11 = GT-USB-7079A: 5A 1 Surface Mount 16 Female -55℃~+85℃ Type-C SMD USB Connectors ROHS C2982481
R46 R47 = RT0402FRE07100KL: RES SMD 100K OHM 1% 1/16W 0402; Manufacturer: Yageo; Power (Watts): 0.063W, 1/16W; Temperature Coefficient: ±50ppm/°C; Part Number: RT0402FRE07100KL; Value: 100 kOhms; ComponentLink1Description: Datasheet; ComponentLink1URL: https://www.yageo.com/upload/media/product/productsearch/datasheet/rchip/PYu-RT_1-to-0.01_RoHS_L_11.pdf; ComponentLink2Description: DigiKey Link; ComponentLink2URL: https://www.digikey.com/en/products/detail/yageo/RT0402FRE07100KL/1071698; Composition: Thin Film; Device Package: 0402 (1005 Metric); Height - Seated (Max): 0.014" (0.35mm); LastUpdated: 26/04/2023 7:20:40 PM; Lifecycle Status: Active; Minimum Order: 1; Number of Terminations: 2; Operating Temperature: -55°C ~ 155°C; Package / Case: 0402 (1005 Metric); Packaging: TapeAndReel; PartId: 3190; Part Status: Active; Price: 0.01; Resistance: 100 kOhms; Series: RT; Size / Dimension: 0.039" L x 0.020" W (1.00mm x 0.50mm); Supplier 1: DigiKey; Supplier Part Number 1: YAG2307CT-ND; Supplier Device Package: 0402; Tolerance: ±1%
R52-R55 = RC0402JR-1310KL: as R1 on sheet Microcontroller; Part Number: RC0402JR-1310KL; Value: 10 kOhms; ComponentLink1Description: Datasheet; ComponentLink1URL: https://www.yageo.com/upload/media/product/productsearch/datasheet/rchip/PYu-RC_Group_51_RoHS_L_11.pdf; ComponentLink2Description: DigiKey Link; ComponentLink2URL: https://www.digikey.com/en/products/detail/yageo/RC0402JR-1310KL/13694115; Composition: Thick Film; Device Package: 0402 (1005 Metric); Features: Moisture Resistant; Height - Seated (Max): 0.016" (0.40mm); LastUpdated: 4/04/2023 7:21:31 PM; Lifecycle Status: Active; Minimum Order: 50000; Number of Terminations: 2; Operating Temperature: -55°C ~ 155°C; Package / Case: 0402 (1005 Metric); PartId: 69237; Part Status: Active; Price: 0; Resistance: 10 kOhms; Series: RC_L; Size / Dimension: 0.039" L x 0.020" W (1.00mm x 0.50mm); Supplier 1: DigiKey; Supplier Part Number 1: 13-RC0402JR-1310KLTR-ND; Supplier Device Package: 0402; Tolerance: ±5%
TP4 = 5016: MF: {'manufacturer': u'Keystone Electronics'}; Package: None; MP: 5016; Value: *; Price: None; Availability: Unavailable
U3 = TPS25750DRJKR: USB, Type-C Controller PMIC 38-WQFN (4x6); MF: {'manufacturer': u'Texas Instruments'}; MP: TPS25750DRJKR; Value: *; Availability: Unavailable; Package: None; Price: None
U4 = TVS2200DRVR: MF: {'manufacturer': u'Texas Instruments'}; MP: TVS2200DRVR; Price: None; Package: None; Availability: Unavailable; Value: *
U5 = CAT24C256WI-G: EEPROM Memory IC 256Kb (32K x 8) IÂ²C 1MHz 500ns 8-SOIC; MF: {'manufacturer': u'ON Semiconductor'}; MP: CAT24C256WI-G; Price: None; Package: None; Availability: Unavailable; Value: *
U9 = ESD122DMXR: 2-channel ESD protection diode for USB Type-C and HDMI 2.0 3-X2SON -40 to 125; MF: {'manufacturer': u'Texas Instruments'}; Package: None; Price: None; Value: *; MP: ESD122DMXR; Availability: Unavailable